# Altium schematic sheet MCU.SchDoc
size A4; SheetNumber: 2; SheetTotal: 4
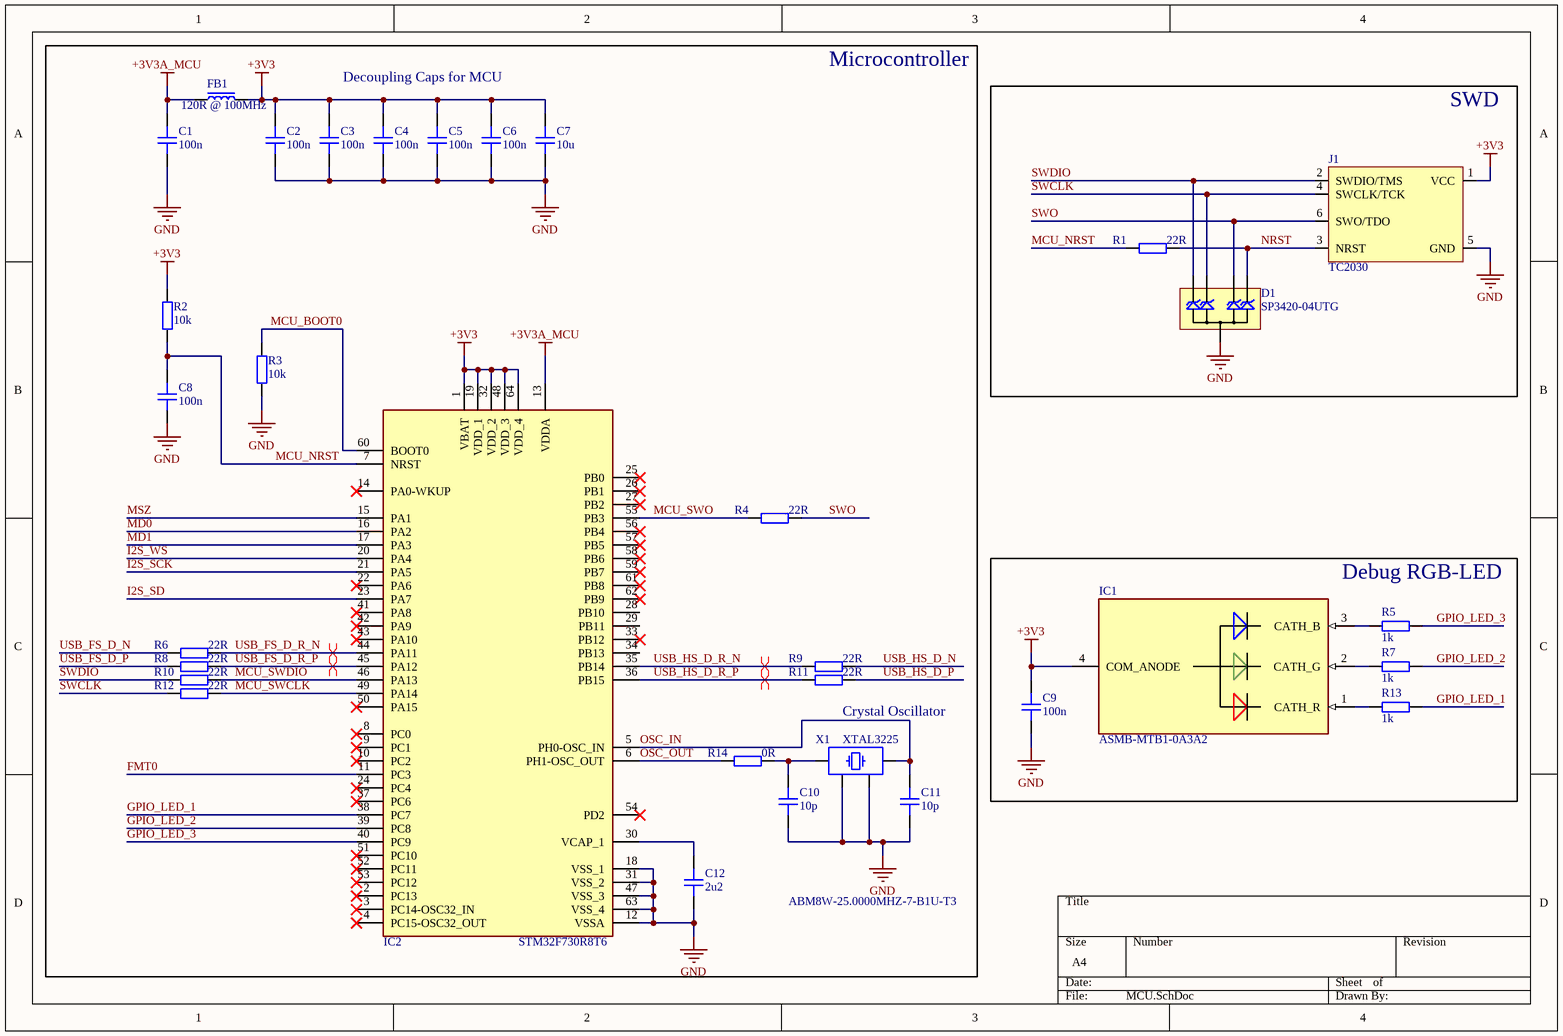
[diagram p0: MCU.SchDoc]

## Parts
C1  100n  [CAP_0402]
C2  100n  [CAP_0402]
C3  100n  [CAP_0402]
C4  100n  [CAP_0402]
C5  100n  [CAP_0402]
C6  100n  [CAP_0402]
C7  10u  [CAP_0603]
C8  100n  [CAP_0402]
C9  100n  [CAP_0402]
C10  10p  [CAP_0402]
C11  10p  [CAP_0402]
C12  2u2  [CAP_0402]
D1  SP3420-04UTG  [uDFN-10]
FB1  120R @ 100MHz  [FB_0402]
IC1  ASMB-MTB1-0A3A2  [AVAGO_PLCC4]
IC2  STM32F730R8T6  [QFP50P1200X1200X160-64N]
J1  TC2030  [TC2030-FP]  (no BOM)
R1  22R  [RES_0402]
R2  10k  [RES_0402]
R3  10k  [RES_0402]
R4  22R  [RES_0402]
R5  1k  [RES_0402]
R6  22R  [RES_0402]
R7  1k  [RES_0402]
R8  22R  [RES_0402]
R9  22R  [RES_0402]
R10  22R  [RES_0402]
R11  22R  [RES_0402]
R12  22R  [RES_0402]
R13  1k  [RES_0402]
R14  0R  [RES_0402]
X1  XTAL3225  [XTAL_3225]

## Blocks framed on the sheet
Microcontroller: C1-C8 C10-C12 FB1 IC2 R2-R4 R6 R8-R12 R14 X1
SWD: D1 J1 R1
Debug RGB-LED: C9 IC1 R5 R7 R13

## Nets
+3V3: C2.2 C3.2 C4.2 C5.2 C6.2 C7.2 C9.2 FB1.2 IC1.4(COM_ANODE) IC2.1(VBAT) IC2.19(VDD_1) IC2.32(VDD_2) IC2.48(VDD_3) IC2.64(VDD_4) J1.1(VCC) R2.1
+3V3A_MCU: C1.2 FB1.1 IC2.13(VDDA)
GND: C1.1 C2.1 C3.1 C4.1 C5.1 C6.1 C7.1 C8.1 C9.1 C10.1 C11.1 C12.1 D1.38(GND) IC2.12(VSSA) IC2.18(VSS_1) IC2.31(VSS_2) IC2.47(VSS_3) IC2.63(VSS_4) J1.5(GND) R3.1 X1.2 X1.4
FMT0: IC2.11(PC3)
GPIO_LED_1: IC2.38(PC7) R13.1
GPIO_LED_2: IC2.39(PC8) R7.1
GPIO_LED_3: IC2.40(PC9) R5.1
I2S_SCK: IC2.21(PA5)
I2S_SD: IC2.23(PA7)
I2S_WS: IC2.20(PA4)
MCU_BOOT0: IC2.60(BOOT0) R3.2
MCU_NRST: C8.2 IC2.7(NRST) R1.1 R2.2
MCU_SWCLK: IC2.49(PA14) R12.2
MCU_SWDIO: IC2.46(PA13) R10.2
MCU_SWO: IC2.55(PB3) R4.1
MD0: IC2.16(PA2)
MD1: IC2.17(PA3)
MSZ: IC2.15(PA1)
NRST: D1.56 J1.3(NRST) R1.2
OSC_IN: C11.2 IC2.5(PH0-OSC_IN) X1.1
OSC_OUT: IC2.6(PH1-OSC_OUT) R14.1
SWCLK: D1.29 J1.4(SWCLK/TCK) R12.1
SWDIO: D1.110 J1.2(SWDIO/TMS) R10.1
SWO: D1.47 J1.6(SWO/TDO) R4.2
USB_FS_D_N: R6.1
USB_FS_D_P: R8.1
USB_FS_D_R_N: IC2.44(PA11) R6.2
USB_FS_D_R_P: IC2.45(PA12) R8.2
USB_HS_D_N: R9.2
USB_HS_D_P: R11.2
USB_HS_D_R_N: IC2.35(PB14) R9.1
USB_HS_D_R_P: IC2.36(PB15) R11.1
NetC10_2: C10.2 R14.2 X1.3
NetC12_2: C12.2 IC2.30(VCAP_1)
NetIC1_1: IC1.1(CATH_R) R13.2
NetIC1_2: IC1.2(CATH_G) R7.2
NetIC1_3: IC1.3(CATH_B) R5.2

Not connected (* = marked no-connect by the designer): IC2 2(PC13)* 3(PC14-OSC32_IN)* 4(PC15-OSC32_OUT)* 8(PC0)* 9(PC1)* 10(PC2)* 14(PA0-WKUP)* 22(PA6)* 24(PC4)* 25(PB0)* 26(PB1)* 27(PB2)* 28(PB10) 29(PB11) 33(PB12)* 34(PB13) 37(PC6)* 41(PA8)* 42(PA9)* 43(PA10)* 50(PA15)* 51(PC10)* 52(PC11)* 53(PC12)* 54(PD2)* 56(PB4)* 57(PB5)* 58(PB6)* 59(PB7)* 61(PB8)* 62(PB9)*

## Layout directives
differential pair: USB_FS_D_R_N, USB_FS_D_R_P, USB_HS_D_R_N, USB_HS_D_R_P

## Notes on the sheet
- Decoupling Caps for MCU
- Crystal Oscillator
- ABM8W-25.0000MHZ-7-B1U-T3

## Library data of the parts
C1-C6 C8-C12 = CAP_0402: Capacitor SMD 0402; Manufacturer: *; Manufacturer Part Number: *; Distributor Link: *; LCSC: *; Rating: *; Dielectric: *
C7 = CAP_0603: Capacitor SMD 0603; Manufacturer: *; Manufacturer Part Number: *; Distributor Link: *; LCSC: *; Rating: *; Dielectric: *
D1 = SP3420-04UTG: TVS Diode Array Low Capacitance ESD Protection 4-Channel (Vwork=3V3, Vclamp=6V); Manufacturer: Littelfuse; Manufacturer Part Number: SP3420-04UTG
FB1 = FB_0402: Ferrite Bead SMD 0402; Manufacturer: *; Manufacturer Part Number: *; Distributor Link: *; LCSC: *
IC1 = ASMB-MTB1-0A3A2: Integrated Circuit; Manufacturer_Name: Avago Technologies; Datasheet Link: https://docs.broadcom.com/docs/AV02-4194EN; Manufacturer_Part_Number: ASMB-MTB1-0A3A2; Mouser Part Number: 630-ASMB-MTB1-0A3A2; Mouser Price/Stock: https://www.mouser.co.uk/ProductDetail/Broadcom-Avago/ASMB-MTB1-0A3A2?qs=ToP8pWlZ0bM7NIiOojjztA%3D%3D
IC2 = STM32F730R8T6: Integrated Circuit; Manufacturer_Name: STMicroelectronics; Datasheet Link: https://www.st.com/resource/en/datasheet/stm32f730r8.pdf; Height: 1.6mm; Manufacturer_Part_Number: STM32F730R8T6; Mouser Part Number: 511-STM32F730R8T6; Mouser Price/Stock: https://www.mouser.co.uk/ProductDetail/STMicroelectronics/STM32F730R8T6?qs=%252BEew9%252B0nqrB2Tb9O5sEwrw%3D%3D; Arrow Part Number: STM32F730R8T6; Arrow Price/Stock: https://www.arrow.com/en/products/stm32f730r8t6/stmicroelectronics?region=nac
J1 = TC2030: Tag-Connect No-Solder SWD Debug Connector DO NOT PLACE; Manufacturer: Tag-Connect; Manufacturer Part Number: TC2030
R1-R14 = RES_0402: Resistor SMD 0402; Manufacturer: *; Manufacturer Part Number: *; Distributor Link: *; LCSC: *
X1 = XTAL_3225: Crystal SMD 3225; Distributor Link: *